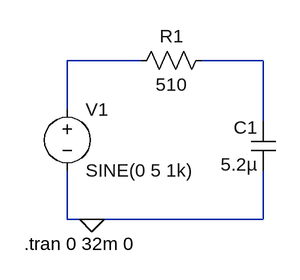
[diagram p0: schematic Low_pass_filter.asc]
Low_pass_filter.asc, the LTspice schematic file:
Version 4
SHEET 1 880 680
WIRE 176 64 80 64
WIRE 336 64 256 64
WIRE 80 128 80 64
WIRE 336 144 336 64
WIRE 80 272 80 208
WIRE 112 272 80 272
WIRE 336 272 336 208
WIRE 336 272 112 272
FLAG 112 272 0
SYMBOL voltage 80 112 R0
WINDOW 123 0 0 Left 0
WINDOW 39 0 0 Left 0
SYMATTR InstName V1
SYMATTR Value SINE(0 5 1k)
SYMBOL cap 352 208 R180
WINDOW 0 24 56 Left 2
WINDOW 3 24 8 Left 2
SYMATTR InstName C1
SYMATTR Value 5.2µ
SYMBOL res 272 48 R90
WINDOW 0 0 56 VBottom 2
WINDOW 3 32 56 VTop 2
SYMATTR InstName R1
SYMATTR Value 510
TEXT 24 304 Left 2 !.tran 0 32m 0

The netlist it stands for:
* Low_pass_filter.asc
V1 N001 0 SINE(0 5 1k)
C1 0 N002 5.2µ
R1 N002 N001 510
.tran 0 32m 0
.backanno
.end